# EAGLE design untitled (EAGLE 9.5.2)
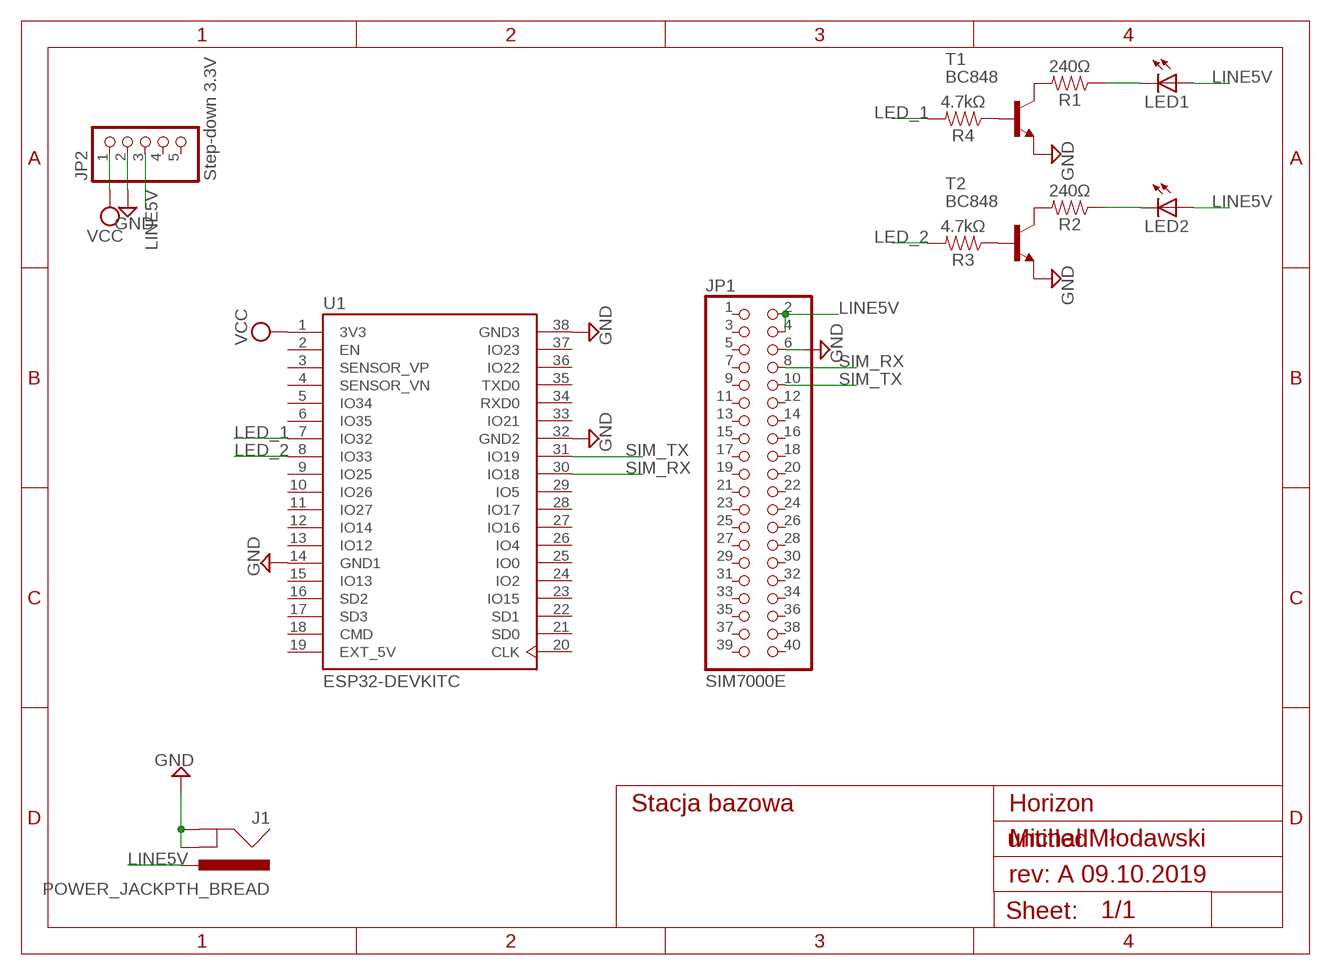
[diagram p0: schematic, sheet 1]

## Parts
J1  POWER_JACKPTH_BREAD  [POWER_JACK_PTH_BREAD]
JP1  SIM7000E  PINHD-2X20  [2X20]
JP2  Step-down 3.3V  PINHD-1X5  [1X05]
LED1  LED5MM  [LED5MM]
LED2  LED5MM  [LED5MM]
R1  240Ω  RESISTOR1206  [1206]
R2  240Ω  RESISTOR1206  [1206]
R3  4.7kΩ  RESISTOR1206  [1206]
R4  4.7kΩ  RESISTOR1206  [1206]
T1  BC848  [SOT23]
T2  BC848  [SOT23]
U1  ESP32-DEVKITC  [MODULE_ESP32-DEVKITC]

## Nets
GND: J1.GND J1.GNDBREAK JP1.6 JP2.2 T1.2(E) T2.2(E) U1.14(GND1) U1.32(GND2) U1.38(GND3)
LED_1: R4.2 U1.7(IO32)
LED_2: R3.2 U1.8(IO33)
LINE5V: J1.PWR JP1.2 JP1.4 JP2.3 LED1.A LED2.A
N$1: R1.2 T1.3(C)
N$2: R2.2 T2.3(C)
N$8: R3.1 T2.1(B)
N$9: R4.1 T1.1(B)
N$11: LED2.K(C) R2.1
N$12: LED1.K(C) R1.1
SIM_RX: JP1.8 U1.30(IO18)
SIM_TX: JP1.10 U1.31(IO19)
VCC: JP2.1 U1.1(3V3)
Unconnected: JP1.1 JP1.3 JP1.5 JP1.7 JP1.9 JP1.11 JP1.12 JP1.13 JP1.14 JP1.15 JP1.16 JP1.17 JP1.18 JP1.19 JP1.20 JP1.21 JP1.22 JP1.23 JP1.24 JP1.25 JP1.26 JP1.27 JP1.28 JP1.29 JP1.30 JP1.31 JP1.32 JP1.33 JP1.34 JP1.35 JP1.36 JP1.37 JP1.38 JP1.39 JP1.40 JP2.4 JP2.5 U1.2(EN) U1.3(SENSOR_VP) U1.4(SENSOR_VN) U1.5(IO34) U1.6(IO35) U1.9(IO25) U1.10(IO26) U1.11(IO27) U1.12(IO14) U1.13(IO12) U1.15(IO13) U1.16(SD2) U1.17(SD3) U1.18(CMD) U1.20(CLK) U1.21(SD0) U1.22(SD1) U1.23(IO15) U1.24(IO2) U1.25(IO0) U1.26(IO4) U1.27(IO16) U1.28(IO17) U1.29(IO5) U1.33(IO21) U1.34(RXD0) U1.35(TXD0) U1.36(IO22) U1.37(IO23)

## Notes on the sheet
- Stacja bazowa | Horizon
- Michał Młodawski
- rev: A 09.10.2019

## Power pins joined to a net without a drawn wire
EXT_5V: U1.19(EXT_5V)

## Library data of the parts
J1 = SparkFun-Connectors:POWER_JACK: Power Jack Connector This is the standard 5.5mm barrel jack for power. The PTH is the most common, proven, reliable, footprint. The Slot footprint only works if the mill layer is transmitted to the PCB fab house so be warned. Here are the connectors we sell at SparkFun: DC Barrel Power Jack/Connector <https://www.sparkfun.com/products/119> (PRT-00119) DC Barrel Power Jack/Connector (SMD) <https://www.sparkfun.com/products/12748> (PRT-12748) DC Barrel Jack Adapter - Breadboard Compatible <https://www.sparkfun.com/products/10811> (PRT-10811) It is used on this SparkFun product (and many, many others): SparkFun RedBoard - Programmed with Arduino <https://www.sparkfun.com/products/12757> (DEV-12757) Also, if you need a mating power supply or connector, please check these out: Wall Adapter Power Supply - 9VDC 650mA <https://www.sparkfun.com/products/298> (TOL-00298) DC Barrel Jack Adapter - Male <https://www.sparkfun.com/products/10287> (PRT-10287); PROD_ID: PRT-10811
JP1 = pinhead:PINHD-2X20: PIN HEADER
JP2 = pinhead:PINHD-1X5: PIN HEADER
LED1 LED2 = adafruit:LED: LED OSRAM: - CHIPLED LG R971, LG N971, LY N971, LG Q971, LY Q971, LO R971, LY R971 LH N974, LH R974 LS Q976, LO Q976, LY Q976 LO Q996 - Hyper CHIPLED LW Q18S LB Q993, LB Q99A, LB R99A - SideLED LS A670, LO A670, LY A670, LG A670, LP A670 LB A673, LV A673, LT A673, LW A673 LH A674 LY A675 LS A676, LA A676, LO A676, LY A676, LW A676 LS A679, LY A679, LG A679 - Hyper Micro SIDELED® LS Y876, LA Y876, LO Y876, LY Y876 LT Y87S - SmartLED LW L88C, LW L88S LB L89C, LB L89S, LG L890 LS L89K, LO L89K, LY L89K LS L896, LA L896, LO L896, LY L896 - TOPLED LS T670, LO T670, LY T670, LG T670, LP T670 LSG T670, LSP T670, LSY T670, LOP T670, LYG T670 LG T671, LOG T671, LSG T671 LB T673, LV T673, LT T673, LW T673 LH T674 LS T676, LA T676, LO T676, LY T676, LB T676, LH T676, LSB T676, LW T676 LB T67C, LV T67C, LT T67C, LS T67K, LO T67K, LY T67K, LW E67C LS E67B, LA E67B, LO E67B, LY E67B, LB E67C, LV E67C, LT E67C LW T67C LS T679, LY T679, LG T679 LS T770, LO T770, LY T770, LG T770, LP T770 LB T773, LV T773, LT T773, LW T773 LH T774 LS E675, LA E675, LY E675, LS T675 LS T776, LA T776, LO T776, LY T776, LB T776 LHGB T686 LT T68C, LB T68C - Hyper Mini TOPLED® LB M676 - Mini TOPLED Santana® LG M470 LS M47K, LO M47K, LY M47K Source: http://www.osram.convergy.de/
R1-R4 = SparkFun-Resistors:RESISTOR: Generic Resistor Package
T1 T2 = transistor:BC848: NPN TRANSISTOR
U1 = ESP32-DEVKITC:ESP32-DEVKITC: ESP32-DEVKITC; AVAILABILITY: Unavailable; DESCRIPTION: EVAL BOARD FOR ESP-WROOM-32; MF: Espressif Systems; MP: ESP32-DEVKITC-32D-F; PACKAGE: None; PRICE: None

## Board
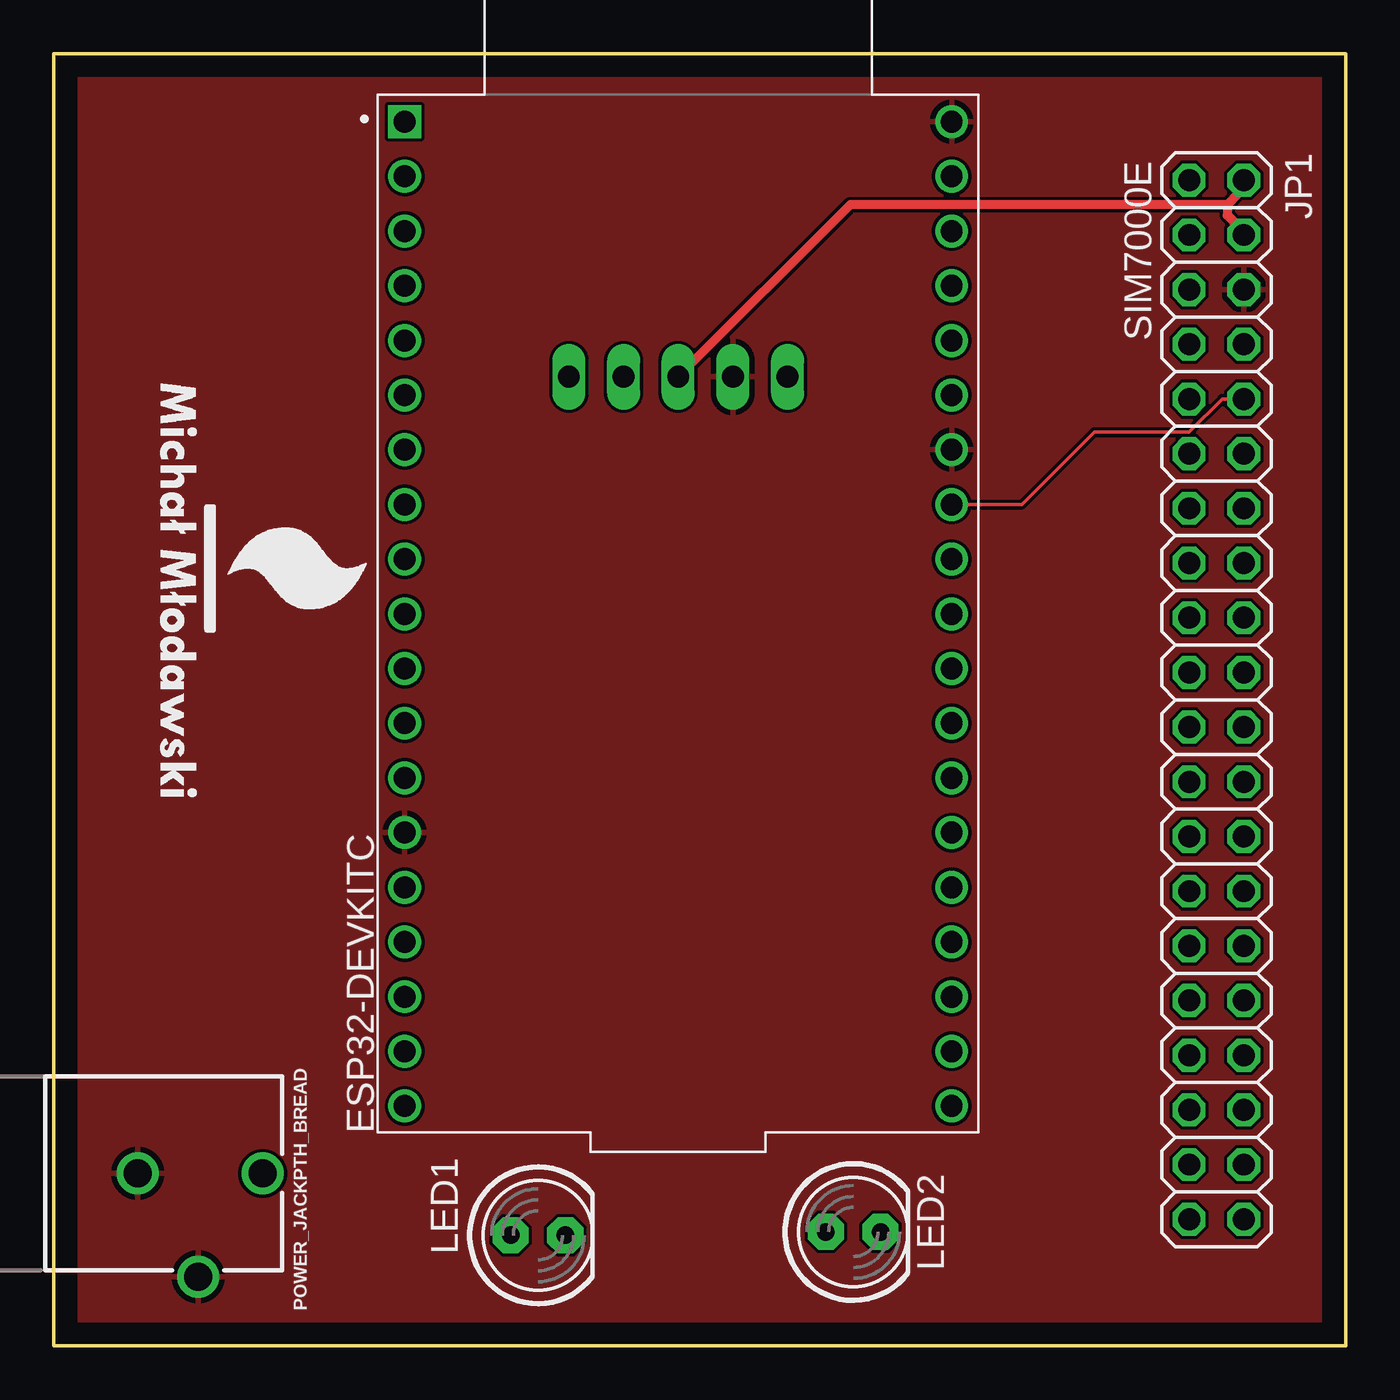
[diagram p1: board, top side]
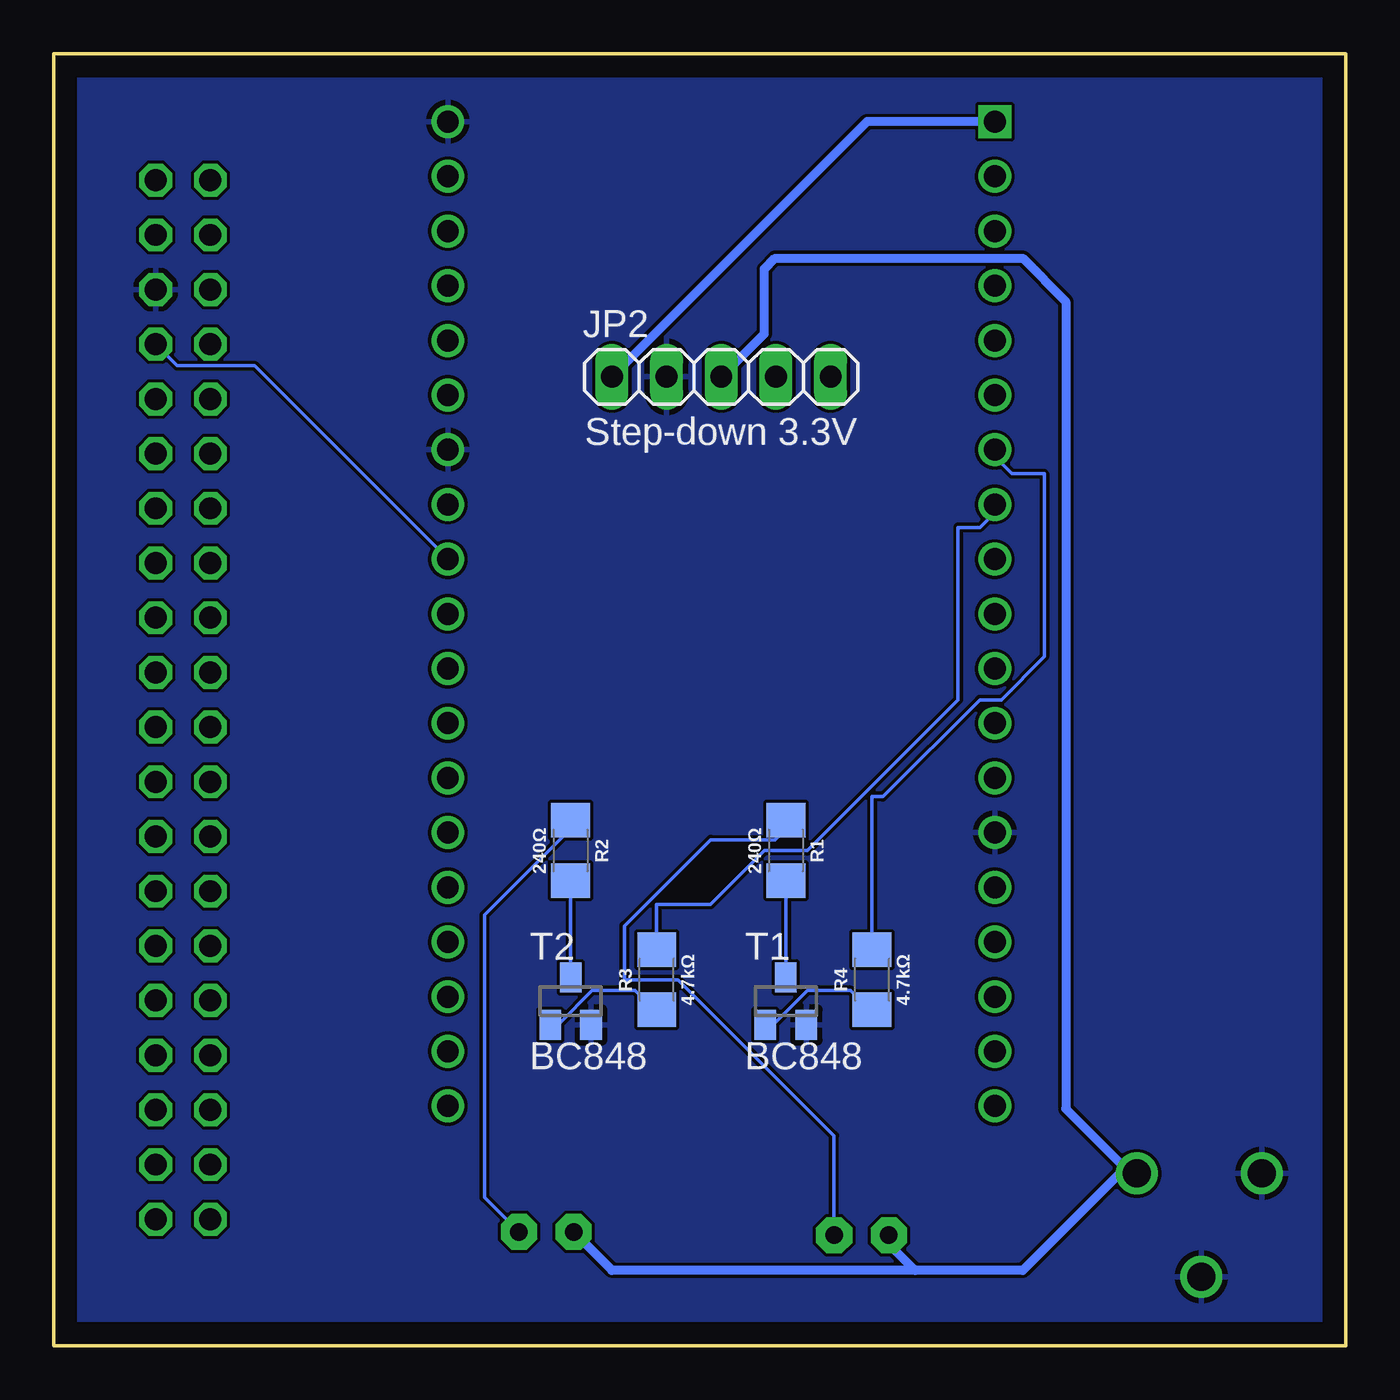
[diagram p2: board, bottom side, seen from below]

Size 60 x 60 mm. Coordinates in mm from the lower left corner, seen from the top.
Outline: 0,60 0,0 60,0 60,60 0,60
Copper layers (1*16): Top 0.035mm / dielectric 1.5mm / Bottom 0.035mm
Design rules "default": minimum track width 6mil, minimum drill 0.35mm, track to track 6mil, track to pad 6mil, pad to pad 6mil, via to via 6mil, smd to smd 6mil, copper to edge 40mil, drill to drill 6mil, minimum pad ring 10mil, minimum via ring 8mil, stop-mask expansion 4mil, vias tented up to drill 0mil, thermal gap 10mil

### Footprints (pad centres in the part's own frame; a part is rotated, then mirrored left to right if it is on the bottom)
POWER_JACK_PTH_BREAD = drill 1.3: GND 0,7.9; GNDBREAK 4.8,10.7; PWR 0,13.7
2X20 = drill 1.016 octagon: 1 -24.13,-1.27; 2 -24.13,1.27; 3 -21.59,-1.27; 4 -21.59,1.27; 5 -19.05,-1.27; 6 -19.05,1.27; 7 -16.51,-1.27; 8 -16.51,1.27; 9 -13.97,-1.27; 10 -13.97,1.27; 11 -11.43,-1.27; 12 -11.43,1.27; 13 -8.89,-1.27; 14 -8.89,1.27; 15 -6.35,-1.27; 16 -6.35,1.27; 17 -3.81,-1.27; 18 -3.81,1.27; 19 -1.27,-1.27; 20 -1.27,1.27; 21 1.27,-1.27; 22 1.27,1.27; 23 3.81,-1.27; 24 3.81,1.27; 25 6.35,-1.27; 26 6.35,1.27; 27 8.89,-1.27; 28 8.89,1.27; 29 11.43,-1.27; 30 11.43,1.27; 31 13.97,-1.27; 32 13.97,1.27; 33 16.51,-1.27; 34 16.51,1.27; 35 19.05,-1.27; 36 19.05,1.27; 37 21.59,-1.27; 38 21.59,1.27; 39 24.13,-1.27; 40 24.13,1.27
1X05 = drill 1.016 long: 1 -5.08,0; 2 -2.54,0; 3 0,0; 4 2.54,0; 5 5.08,0
LED5MM = drill 0.813 pad 1.676 octagon: A -1.27,0; K 1.27,0
1206 = smd 1.6 x 1.8: 1 -1.4,0; 2 1.4,0
SOT23 = smd 1 x 1.4: 1 -0.95,-1.1; 2 0.95,-1.1; 3 0,1.1
MODULE_ESP32-DEVKITC = drill 1.02 square: 1 -12.7,22.85 | drill 1.02: 2 -12.7,20.31; 3 -12.7,17.77; 4 -12.7,15.23; 5 -12.7,12.69; 6 -12.7,10.15; 7 -12.7,7.61; 8 -12.7,5.07; 9 -12.7,2.53; 10 -12.7,-0.01; 11 -12.7,-2.55; 12 -12.7,-5.09; 13 -12.7,-7.63; 14 -12.7,-10.17; 15 -12.7,-12.71; 16 -12.7,-15.25; 17 -12.7,-17.79; 18 -12.7,-20.33; 19 -12.7,-22.87; 20 12.7,-22.87; 21 12.7,-20.33; 22 12.7,-17.79; 23 12.7,-15.25; 24 12.7,-12.71; 25 12.7,-10.17; 26 12.7,-7.63; 27 12.7,-5.09; 28 12.7,-2.55; 29 12.7,-0.01; 30 12.7,2.53; 31 12.7,5.07; 32 12.7,7.61; 33 12.7,10.15; 34 12.7,12.69; 35 12.7,15.23; 36 12.7,17.77; 37 12.7,20.31; 38 12.7,22.85

### Placement (x,y rotation side)
J1  -4,8 270 top
JP1  54,30 270 top
JP2  29,45 0 bottom
LED1  22.49,5.13 0 top
LED2  37.13,5.28 0 top
R1  26,23 270 bottom
R2  36,23 270 bottom
R3  32,17 90 bottom
R4  22,17 90 bottom
T1  26,16 0 bottom
T2  36,16 0 bottom
U1  29,34 0 top

### Tracks (layer width: path | path; a pad name or v marks a point on that pad's centre or on a via)
GND
  pour Top: -4,65 -4,2 0,-2 60,-2 64,2 64,58 59,63 57,65
  pour Bottom: -5,66 -5,1 -1,-3 60,-3 65,2 65,58 57,66
LED_1
  Bottom 0.152: R4.2 22,25.5 21.5,25.5 17,30 16,30 14,32 14,40.5 15.5,40.5 16.5,41.5 U1.7
LED_2
  Bottom 0.152: R3.2 32,20.5 29.5,20.5 27,23 25,23 18,30 18,38 17,38 16,39 U1.8
LINE5V
  Top 0.406: JP2.3 37,53 54.5,53 | 54.5,53 55,53.5 55,54 JP1.2 | 54.5,53 54.5,52.5 55,52 JP1.4
  Bottom 0.406: J1.PWR 10,8 | 10,8 10.5,8 15,3.5 20,3.5 | JP2.3 27,47 27,50 26.5,50.5 15,50.5 13,48.5 13,11 10,8 | 20,3.5 34.08,3.5 LED2.A | LED1.A 21.22,4.72 20,3.5
N$1
  Bottom 0.152: R1.2 T1.3
N$2
  Bottom 0.152: R2.2 T2.3
N$8
  Bottom 0.152: T2.1 36.5,15 35,16.5 33,16.5 32.5,16 32,16 R3.1
N$9
  Bottom 0.152: T1.1 26.5,15 25,16.5 23,16.5 22.5,16 22,16 R4.1
N$11
  Bottom 0.152: R2.1 36,24 40,20 40,6.88 LED2.K
N$12
  Bottom 0.152: R1.1 26,24 26.5,23.5 29.5,23.5 33.5,19.5 33.5,17 31,17 23.76,9.76 LED1.K
SIM_RX
  Bottom 0.152: U1.30 50.68,45.51 54.27,45.51 JP1.8
SIM_TX
  Top 0.152: JP1.10 54.27,43.97 52.72,42.42 48.32,42.42 44.97,39.07 U1.31
VCC
  Bottom 0.406: U1.1 22.23,56.85 JP2.1